# Altium schematic sheet ESP8266Watch-v1-Sch.schdoc
size 304 x 130 mm
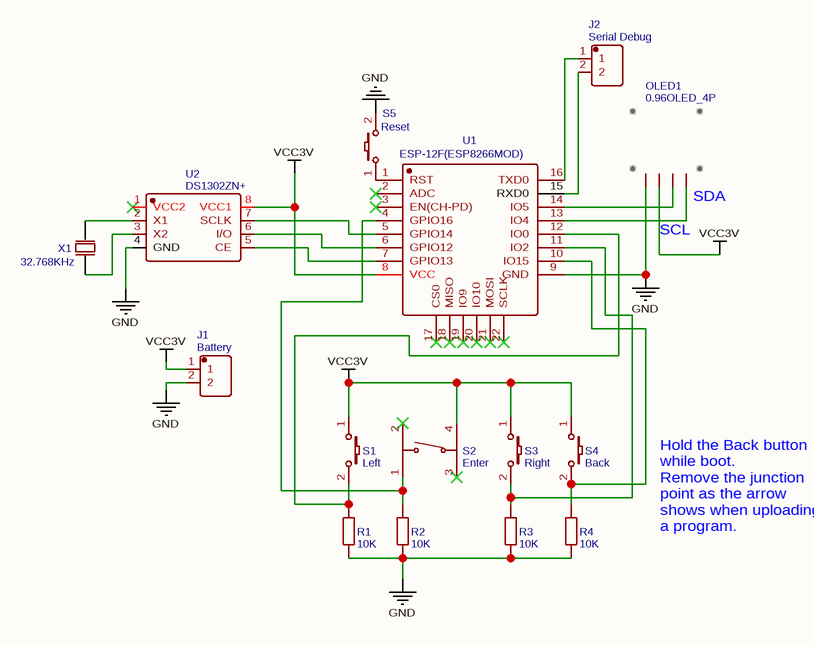
[diagram p0: ESP8266Watch-v1-Sch.schdoc]

## Parts
J1  Battery  [1.25T-1-2A]
J2  Serial Debug  [1.25T-1-2A]
OLED1  0.96OLED_4P  [0.96OLED_4P]
R1  10K  [R0603]
R2  10K  [R0603]
R3  10K  [R0603]
R4  10K  [R0603]
S1  Left  [KEY-SMD_2P-L6.2-W3.6-LS8.0]
S2  Enter  [SW-SMD_4P-L4.5-W4.5-P3.00-LS7.0]
S3  Right  [KEY-SMD_2P-L6.2-W3.6-LS8.0]
S4  Back  [KEY-SMD_2P-L6.2-W3.6-LS8.0]
S5  Reset  [KEY-SMD_2P-L6.2-W3.6-LS8.0]
U1  ESP-12F(ESP8266MOD)  [WIFIM-SMD_ESP-12F-ESP8266MOD]
U2  DS1302ZN+  [SOIC-8_L4.9-W3.9-P1.27-LS6.0-BL]
X1  32.768KHz  [OSC-TH_BD2.0-P0.70-D0.3]

## Nets
GND: J1.2 OLED1.1 R1.1 R2.1 R3.1 R4.1 S5.2 U1.9(GND) U2.4(GND)
VCC3V: J1.1 OLED1.2 S1.1 S2.4 S3.1 S4.1 U1.8(VCC) U2.8(VCC1)
NetJ2_1: J2.1 U1.16(TXD0)
NetJ2_2: J2.2 U1.15(RXD0)
NetOLED1_3: OLED1.3 U1.14(IO5)
NetOLED1_4: OLED1.4 U1.13(IO4)
NetR1_2: R1.2 S1.2 U1.12(IO0)
NetR2_2: R2.2 S2.1 U1.4(GPIO16)
NetR3_2: R3.2 S3.2 U1.11(IO2)
NetR4_2: R4.2 S4.2 U1.10(IO15)
NetS5_1: S5.1 U1.1(RST)
NetU1_5: U1.5(GPIO14) U2.7(SCLK)
NetU1_6: U1.6(GPIO12) U2.6(I/O)
NetU1_7: U1.7(GPIO13) U2.5(CE)
NetU2_2: U2.2(X1) X1.2(OSC2)
NetU2_3: U2.3(X2) X1.1(OSC1)

Not connected (* = marked no-connect by the designer): S2 2* 3*; U1 2(ADC)* 3(EN(CH-PD))* 17(CS0)* 18(MISO)* 19(IO9)* 20(IO10)* 21(MOSI)* 22(SCLK)*; U2 1(VCC2)*

## Notes on the sheet
- (near OLED1) SDA
- (near OLED1) SCL
- Hold the Back button
  while boot.
  Remove the junction
  point as the arrow
  shows when uploading
  a program.
- (in symbol 0.96OLED_4P) Hello World!!!

## Library data of the parts
J1 = Battery: BOM_Manufacturer: ReliaPro; BOM_Supplier Part: C2324; BOM_Supplier: LCSC; BOM_Manufacturer Part: 1.25T-1-2A; spicePre: J; spiceSymbolName: 1.25T-1-2A_C2324
J2 = Serial Debug: BOM_Manufacturer: ReliaPro; BOM_Supplier Part: C2324; BOM_Supplier: LCSC; BOM_Manufacturer Part: 1.25T-1-2A; spicePre: J; spiceSymbolName: 1.25T-1-2A_C2324
OLED1 = 0.96OLED_4P: Contributor: LCEDA_Lib; BOM_Supplier: LCSC; spicePre: O; spiceSymbolName: 0.96OLED_4P
R1-R4 = 10K: BOM_Manufacturer: YAGEO; BOM_Manufacturer Part: RT0603DRD0710KL; nameAlias: Resistance (Ohms); Contributor: LCSC; BOM_Supplier: LCSC; BOM_Supplier Part: C136944; BOM_JLCPCB Part Class: Extended Part; spicePre: R; spiceSymbolName: RT0603DRD0710KL
S1 = Left: BOM_Manufacturer Part: K2-1107ST-A4SW-06; Contributor: LCEDA_Lib; 制造商: 韩国韩荣; BOM_Supplier Part: C118141; BOM_Supplier: LCSC; spicePre: K; spiceSymbolName: K2-3.6×6.1_SMD
S2 = Enter: BOM_Manufacturer: XKB Enterprise; BOM_Manufacturer Part: TS-1109S-B-F; Contributor: LCSC; BOM_Supplier: LCSC; BOM_Supplier Part: C480319; BOM_JLCPCB Part Class: Extended Part; spicePre: S; spiceSymbolName: TS-1109S-B-F
S3 = Right: BOM_Manufacturer Part: K2-1107ST-A4SW-06; Contributor: LCEDA_Lib; 制造商: 韩国韩荣; BOM_Supplier Part: C118141; BOM_Supplier: LCSC; spicePre: K; spiceSymbolName: K2-3.6×6.1_SMD
S4 = Back: BOM_Manufacturer Part: K2-1107ST-A4SW-06; Contributor: LCEDA_Lib; 制造商: 韩国韩荣; BOM_Supplier Part: C118141; BOM_Supplier: LCSC; spicePre: K; spiceSymbolName: K2-3.6×6.1_SMD
S5 = Reset: BOM_Manufacturer Part: K2-1107ST-A4SW-06; Contributor: LCEDA_Lib; 制造商: 韩国韩荣; BOM_Supplier Part: C118141; BOM_Supplier: LCSC; spicePre: K; spiceSymbolName: K2-3.6×6.1_SMD
U1 = ESP-12F(ESP8266MOD): BOM_Manufacturer: Ai-Thinker; BOM_Supplier: LCSC; BOM_Manufacturer Part: ESP-12F(ESP8266MOD); BOM_Supplier Part: C82891; BOM_JLCPCB Part Class: Extended Part; spicePre: U; spiceSymbolName: ESP-12F(ESP8266MOD)
U2 = DS1302ZN+: BOM_Manufacturer: MAXIM; BOM_Manufacturer Part: DS1302Z+T&R; sourceId: 5z5nhzR82; spicePre: X; timeStamp: 1459471349; BOM_Supplier: LCSC; BOM_Supplier Part: C8959; BOM_JLCPCB Part Class: Basic Part; spiceSymbolName: DS1302ZN+
X1 = 32.768KHz: BOM_Manufacturer: CITIZEN; BOM_Manufacturer Part: CFS-20632768DZFB; nameAlias: Frequency; Contributor: LCSC; BOM_Supplier: LCSC; BOM_Supplier Part: C100098; BOM_JLCPCB Part Class: Extended Part; spicePre: X; spiceSymbolName: CFS-20632768DZFB